# Altium schematic sheet Pump and Power IO.SchDoc: Actuator and Power Connection Terminals
size A; DrawnBy: Adam Vadala-Roth; DocumentNumber: 3; Revision: 2.1a; SheetNumber: 3; SheetTotal: 5
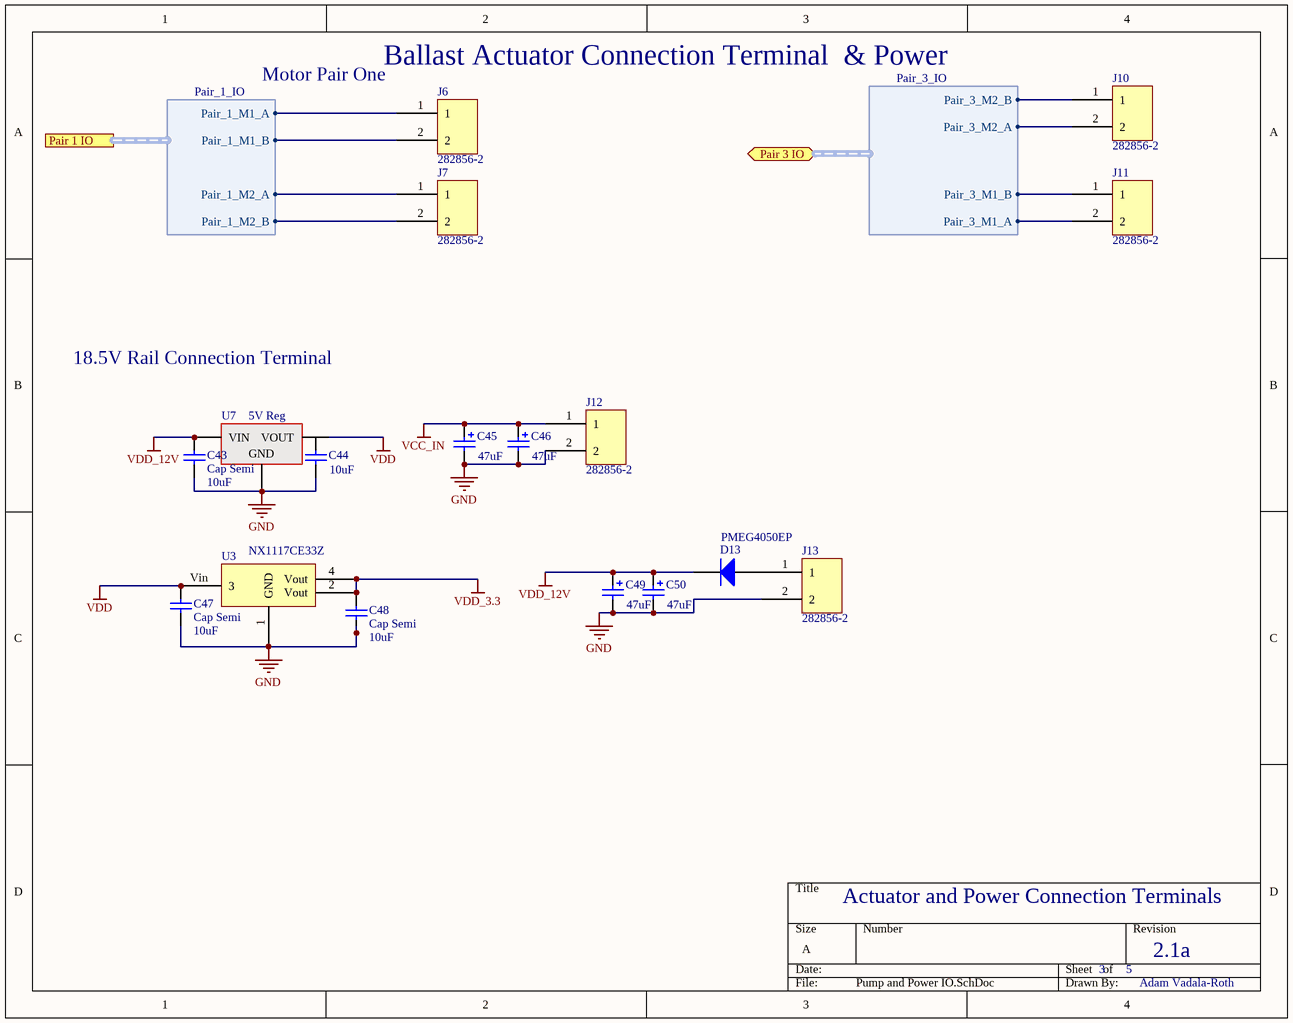
[diagram p0: Pump and Power IO.SchDoc]

## Parts
C43  Cap Semi  value 10uF  [C1206]
C44  value 10uF  [C1206]  (hidden comment: Cap Semi)
C45  value 47uF  [CAPPR2-5x6.8]  (hidden comment: Cap Pol2)
C46  value 47uF  [CAPPR2-5x6.8]  (hidden comment: Cap Pol2)
C47  Cap Semi  value 10uF  [C1206]
C48  Cap Semi  value 10uF  [C1206]
C49  value 47uF  [CAPPR2-5x6.8]  (hidden comment: Cap Pol2)
C50  value 47uF  [CAPPR2-5x6.8]  (hidden comment: Cap Pol2)
D13  PMEG4050EP  [PMEG4050EP]
J6  282856-2  [282856-2]
J7  282856-2  [282856-2]
J10  282856-2  [282856-2]
J11  282856-2  [282856-2]
J12  282856-2  [282856-2]
J13  282856-2  [282856-2]
U3  NX1117CE33Z  [NX1117CE33Z]
U7  5V Reg  [DPAK-3]

## Ports
Pair 1 IO (harness Pair_1_IO), Pair 3 IO (harness Pair_3_IO)

## Harnesses
Pair_1_IO: Pair_1_M1_A, Pair_1_M1_B, Pair_1_M2_A, Pair_1_M2_B
Pair_3_IO: Pair_3_M1_A, Pair_3_M1_B, Pair_3_M2_A, Pair_3_M2_B

## Nets
GND: C43.1 C44.1 C45.2 C46.2 C47.1 C48.1 C49.2 C50.2 J12.2 J13.2 U3.1(GND) U7.2(GND)
VCC_IN: C45.1 C46.1 J12.1
VDD: C47.2 U3.Vin(3) U7.3(VOUT)
VDD_3.3: C48.2 U3.2(Vout) U3.4(Vout)
VDD_12V: C43.2 C49.1 C50.1 D13.2(K) U7.1(VIN)
NetD13_1: D13.1(A) J13.1
NetJ6_1: J6.1 ; port Pair 1 IO.Pair_1_M1_A
NetJ6_2: J6.2 ; port Pair 1 IO.Pair_1_M1_B
NetJ7_1: J7.1 ; port Pair 1 IO.Pair_1_M2_A
NetJ7_2: J7.2 ; port Pair 1 IO.Pair_1_M2_B
NetJ10_1: J10.1 ; port Pair 3 IO.Pair_3_M2_B
NetJ10_2: J10.2 ; port Pair 3 IO.Pair_3_M2_A
NetJ11_1: J11.1 ; port Pair 3 IO.Pair_3_M1_B
NetJ11_2: J11.2 ; port Pair 3 IO.Pair_3_M1_A

Not connected (* = marked no-connect by the designer): C44 2

## Notes on the sheet
- (near J6) Motor Pair One
- (near J6) Ballast Actuator Connection Terminal  & Power
- 18.5V Rail Connection Terminal

## Library data of the parts
C43 C44 C47 C48 = Cap Semi: Capacitor (Semiconductor SIM Model); Published: 8-Jun-2000; LatestRevisionDate: 29-May-2009; LatestRevisionNote: IPC-7351 Footprint Added.; PackageReference: C1206; Publisher: Altium Limited; PackageDescription: Chip Capacitor
C45 C46 C49 C50 = Cap Pol2: Polarized Capacitor (Axial); Published: 8-Jun-2000; LatestRevisionDate: 17-Jul-2002; LatestRevisionNote: Re-released for DXP Platform.; PackageReference: POLAR0.8; Publisher: Altium Limited; PackageDescription: Polarized Capacitor; 2 Leads
D13 = Diode: Default Diode; Published: 8-Jun-2000; LatestRevisionDate: 17-Jul-2002; LatestRevisionNote: Re-released for DXP Platform.; PackageVersion: Sep-1996; PackageReference: SMC; Publisher: Altium Limited; PackageDescription: DO-214-AB/SMC; 2 C-Bend Leads; Body 7.9 x 5.9 mm, inc. leads (LxW); Code_JEDEC: DO-214-AB
J6 J7 J10-J13 = 282856-2: Two pole screw terminal
U3 = NX1117CE33Z: 3.3v Linear Regulator
U7 = VOLT REG: Voltage regulator; Published: 24-Mar-1999; LatestRevisionDate: 29-May-2009; LatestRevisionNote: IPC-7351 Footprint Added.; PackageReference: D2PAK; Publisher: Altium Limited; PackageDescription: 3-Pin Transistor Outline Package 2.54 mm Pitch, 15.1 mm Lead Span